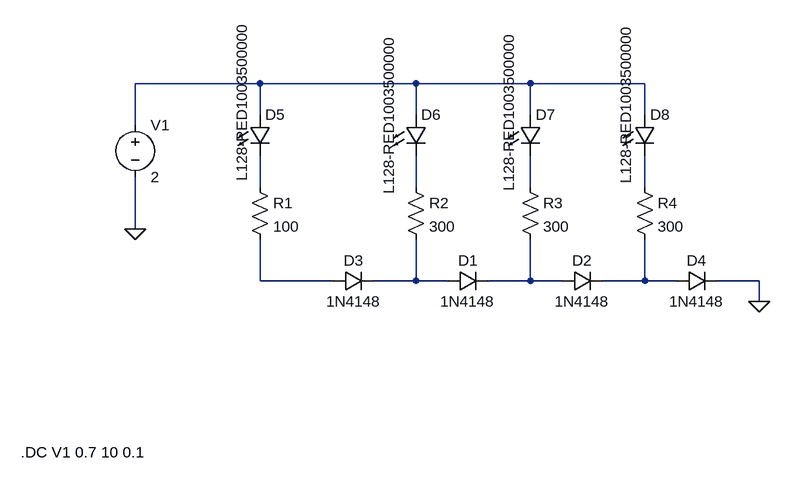
[diagram p0: schematic Draft1.asc]
Draft1.asc, the LTspice schematic file:
Version 4
SHEET 1 1336 680
WIRE 224 -192 32 -192
WIRE 464 -192 224 -192
WIRE 640 -192 464 -192
WIRE 816 -192 640 -192
WIRE 224 -144 224 -192
WIRE 464 -144 464 -192
WIRE 640 -144 640 -192
WIRE 816 -144 816 -192
WIRE 32 -128 32 -192
WIRE 224 -32 224 -80
WIRE 464 -32 464 -80
WIRE 640 -32 640 -80
WIRE 816 -32 816 -80
WIRE 32 32 32 -48
WIRE 224 112 224 48
WIRE 336 112 224 112
WIRE 464 112 464 48
WIRE 464 112 400 112
WIRE 512 112 464 112
WIRE 640 112 640 48
WIRE 640 112 576 112
WIRE 688 112 640 112
WIRE 816 112 816 48
WIRE 816 112 752 112
WIRE 864 112 816 112
WIRE 992 112 928 112
WIRE 992 144 992 112
FLAG 32 32 0
FLAG 992 144 0
SYMBOL Voltage 32 -144 R0
SYMATTR InstName V1
SYMATTR Value 2
SYMBOL LED 208 -144 R0
WINDOW 3 -12 103 VLeft 2
SYMATTR InstName D5
SYMATTR Value L128-RED1003500000
SYMBOL Res 208 -48 R0
SYMATTR InstName R1
SYMATTR Value 100
SYMBOL Res 448 -48 R0
SYMATTR InstName R2
SYMATTR Value 300
SYMBOL Res 624 -48 R0
SYMATTR InstName R3
SYMATTR Value 300
SYMBOL Res 800 -48 R0
SYMATTR InstName R4
SYMATTR Value 300
SYMBOL diode 336 128 R270
WINDOW 0 32 32 VTop 2
WINDOW 3 0 32 VBottom 2
SYMATTR InstName D3
SYMATTR Value 1N4148
SYMBOL diode 512 128 R270
WINDOW 0 32 32 VTop 2
WINDOW 3 0 32 VBottom 2
SYMATTR InstName D1
SYMATTR Value 1N4148
SYMBOL diode 688 128 R270
WINDOW 0 32 32 VTop 2
WINDOW 3 0 32 VBottom 2
SYMATTR InstName D2
SYMATTR Value 1N4148
SYMBOL diode 864 128 R270
WINDOW 0 32 32 VTop 2
WINDOW 3 0 32 VBottom 2
SYMATTR InstName D4
SYMATTR Value 1N4148
SYMBOL LED 448 -144 R0
WINDOW 3 -26 123 VLeft 2
SYMATTR InstName D6
SYMATTR Value L128-RED1003500000
SYMBOL LED 624 -144 R0
WINDOW 3 -17 118 VLeft 2
SYMATTR InstName D7
SYMATTR Value L128-RED1003500000
SYMBOL LED 800 -144 R0
WINDOW 3 -13 107 VLeft 2
SYMATTR InstName D8
SYMATTR Value L128-RED1003500000
TEXT -144 376 Left 2 !.DC V1 0.7 10 0.1

The netlist it stands for:
* Draft1.asc
V1 N001 0 2
D5 N001 N002 L128-RED1003500000
R1 N002 N006 100
R2 N003 N007 300
R3 N004 N008 300
R4 N005 N009 300
D3 N006 N007 1N4148
D1 N007 N008 1N4148
D2 N008 N009 1N4148
D4 N009 0 1N4148
D6 N001 N003 L128-RED1003500000
D7 N001 N004 L128-RED1003500000
D8 N001 N005 L128-RED1003500000
.model D D
.lib standard.dio
.DC V1 0.7 10 0.1
.backanno
.end